# Altium schematic sheet Logic_Unit.SchDoc
size A3
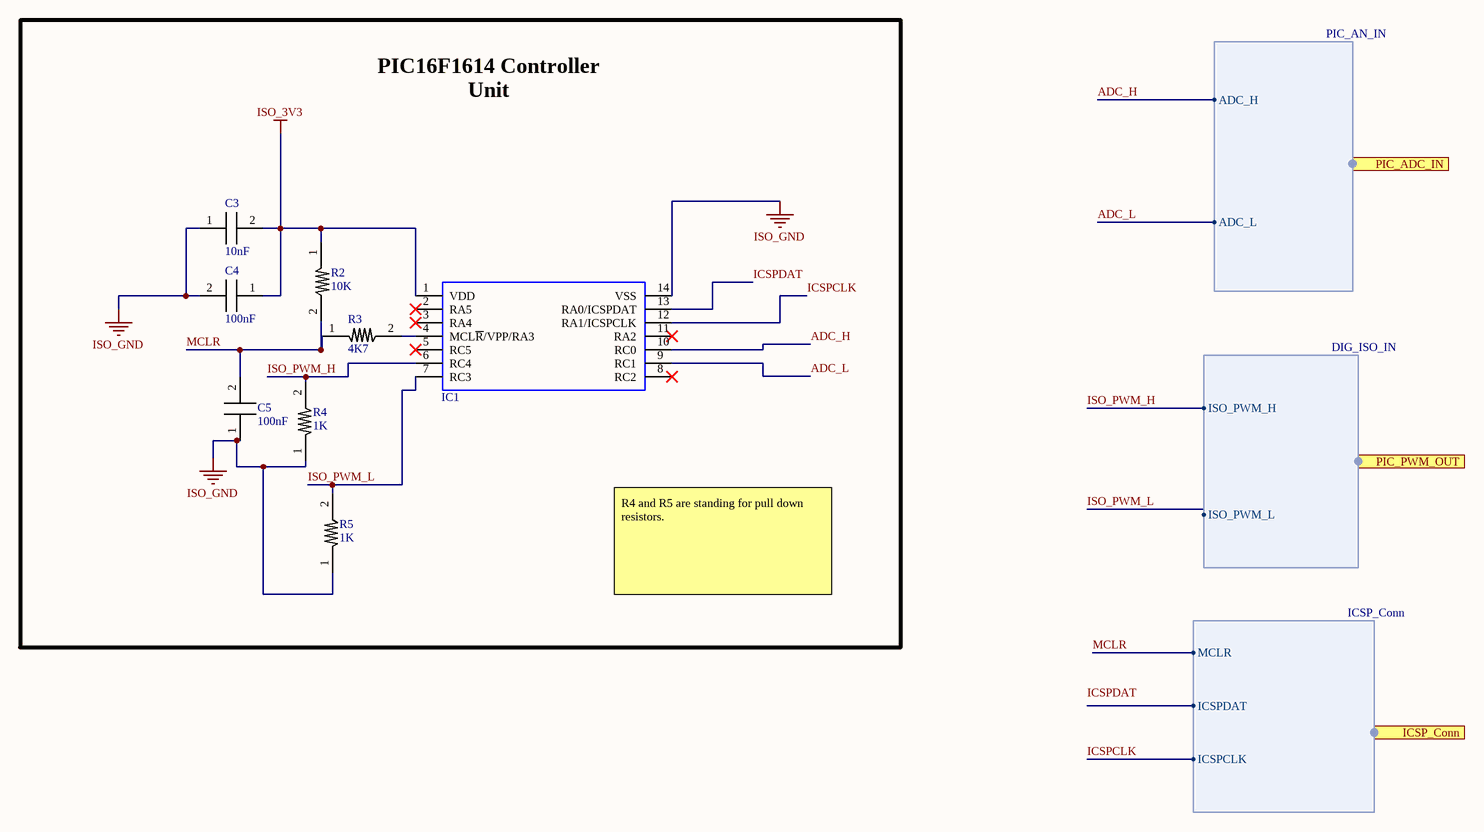
[diagram p0: Logic_Unit.SchDoc]

## Parts
C3  Parameter 1: 10nF  (hidden comment: CAP 10nF)
C4  Parameter 1: 100nF  (hidden comment: CAP 100nF)
C5  Parameter 1: 100nF  (hidden comment: CAP 100nF)
IC1  IC PIC16, PIC16F1614  [PIC16F1613]  (value not drawn)
R2  Parameter 1: 10K  (hidden comment: RES, 10K, 0603)
R3  Parameter 1: 4K7  (hidden comment: RES, 4K7, 0603)
R4  Parameter 1: 1K  (hidden comment: RES, 1K, 0603)
R5  Parameter 1: 1K  (hidden comment: RES, 1K, 0603)

## Ports
ICSP_Conn (harness ICSP_Conn), PIC_ADC_IN (harness PIC_AN_IN), PIC_PWM_OUT (harness DIG_ISO_IN)

## Harnesses
PIC_AN_IN: ADC_H, ADC_L
DIG_ISO_IN: ISO_PWM_H, ISO_PWM_L
ICSP_Conn: MCLR, ICSPDAT, ICSPCLK

## Nets
ISO_3V3: C3.2 C4.1 IC1.1(VDD) R2.1
ISO_GND: C3.1 C4.2 C5.1 IC1.14(VSS) R4.1 R5.1
ADC_H: IC1.10(RC0) ; port PIC_ADC_IN.ADC_H
ADC_L: IC1.9(RC1) ; port PIC_ADC_IN.ADC_L
ICSPCLK: IC1.12(RA1/ICSPCLK) ; port ICSP_Conn.ICSPCLK
ICSPDAT: IC1.13(RA0/ICSPDAT)
ISO_PWM_H: IC1.6(RC4) R4.2 ; port PIC_PWM_OUT.ISO_PWM_H
ISO_PWM_L: IC1.7(RC3) R5.2 ; port PIC_PWM_OUT.ISO_PWM_L
MCLR: C5.2 R2.2 R3.1 ; port ICSP_Conn.MCLR
NetIC1_4: IC1.4(MCL~{R}/VPP/RA3) R3.2

Not connected (* = marked no-connect by the designer): IC1 2(RA5)* 3(RA4)* 5(RC5)* 8(RC2)* 11(RA2)*

## Notes on the sheet
- PIC16F1614 Controller Unit
- R4 and R5 are standing for pull down resistors.
- Labels drawn without touching a wire or pin: ICSPDAT